# Altium schematic sheet BACKPMAN21_Charger.SchDoc
size A3
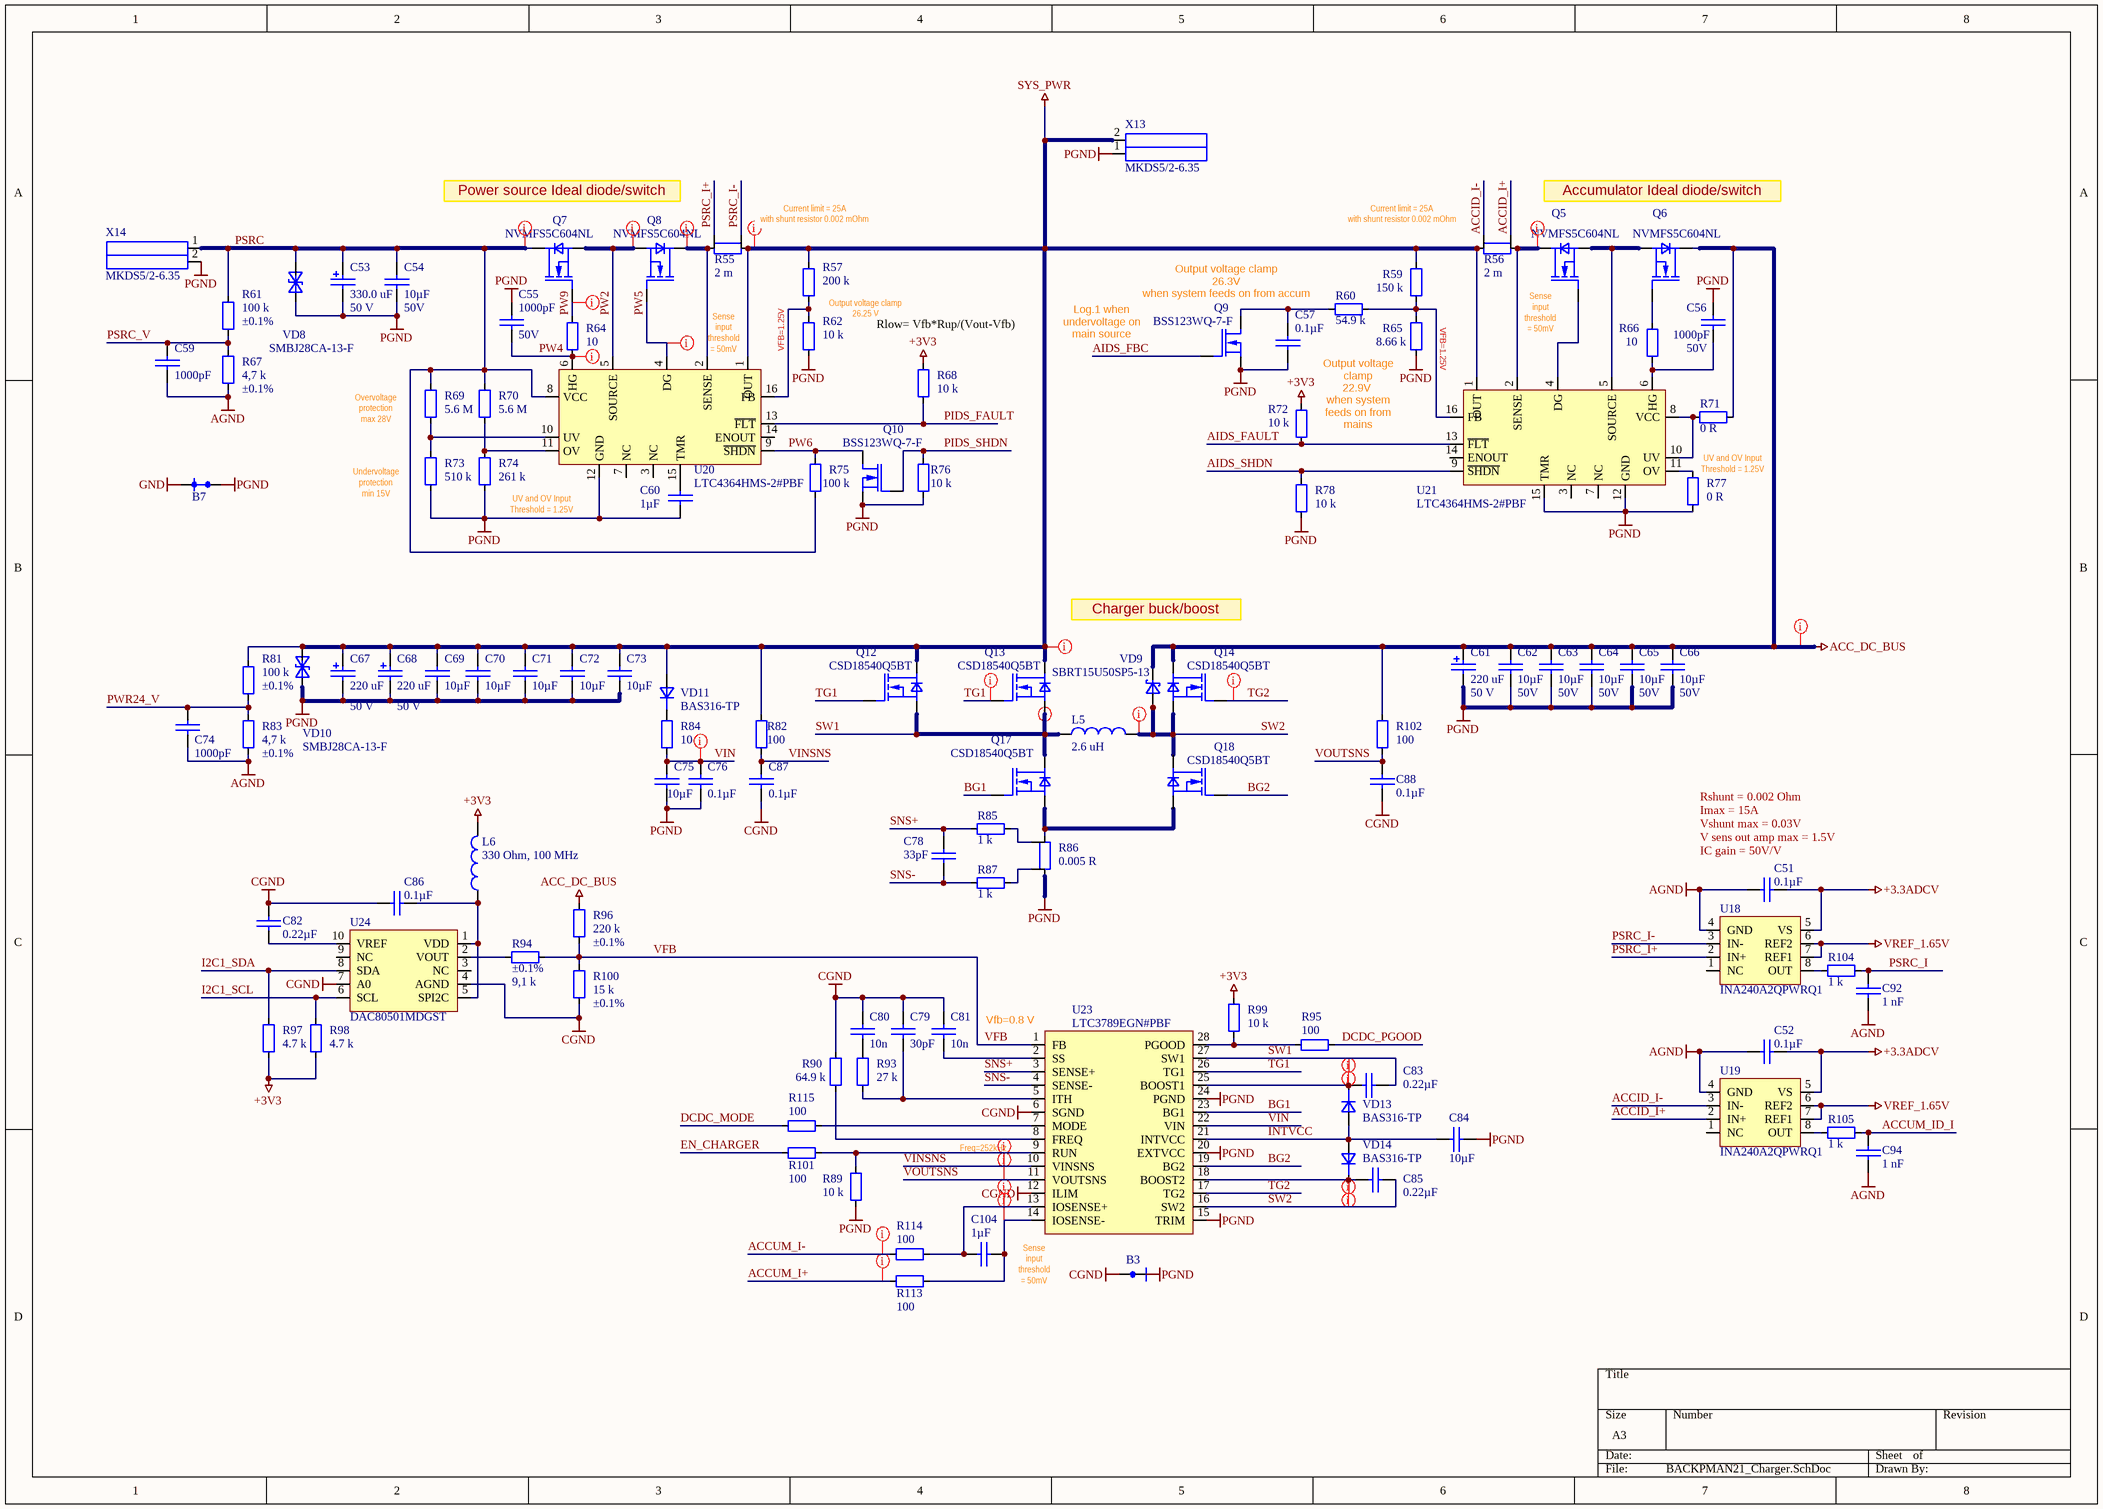
[diagram p0: BACKPMAN21_Charger.SchDoc]

## Parts
B3  Net tie 0.3mm  [Net tee 0.3 mm]  (value not drawn)  (net tie, no BOM)
B7  Net tie 1206  [Net tee 1206]  (value not drawn)  (net tie, no BOM)
C51  value 0.1µF  [0603 CAP]  (hidden comment: Capacitor)
C52  value 0.1µF  [0603 CAP]  (hidden comment: Capacitor)
C53  value 330.0 uF  Voltage: 50 V  [UUD1V331MNL1GS]  (hidden comment: EEE-FT1H331GP)
C54  value 10µF  Voltage - Rated: 50V  [1210 CAP]  (hidden comment: Capacitor)
C55  value 1000pF  Voltage - Rated: 50V  [0603 CAP]  (hidden comment: Capacitor)
C56  value 1000pF  Voltage - Rated: 50V  [0603 CAP]  (hidden comment: Capacitor)
C57  value 0.1µF  [0603 CAP]  (hidden comment: Capacitor)
C59  value 1000pF  [0603 CAP]  (hidden comment: Capacitor)
C60  value 1µF  [0603 CAP]  (hidden comment: Capacitor)
C61  value 220 uF  Voltage: 50 V  [Panasonic G]  (hidden comment: EEH-ZS1H221P)
C62  value 10µF  Voltage - Rated: 50V  [1210 CAP]  (hidden comment: Capacitor)
C63  value 10µF  Voltage - Rated: 50V  [1210 CAP]  (hidden comment: Capacitor)
C64  value 10µF  Voltage - Rated: 50V  [1210 CAP]  (hidden comment: Capacitor)
C65  value 10µF  Voltage - Rated: 50V  [1210 CAP]  (hidden comment: Capacitor)
C66  value 10µF  Voltage - Rated: 50V  [1210 CAP]  (hidden comment: Capacitor)
C67  value 220 uF  Voltage: 50 V  [Panasonic G]  (hidden comment: EEH-ZS1H221P)
C68  value 220 uF  Voltage: 50 V  [Panasonic G]  (hidden comment: EEH-ZS1H221P)
C69  value 10µF  [1210 CAP]  (hidden comment: Capacitor)
C70  value 10µF  [1210 CAP]  (hidden comment: Capacitor)
C71  value 10µF  [1210 CAP]  (hidden comment: Capacitor)
C72  value 10µF  [1210 CAP]  (hidden comment: Capacitor)
C73  value 10µF  [1210 CAP]  (hidden comment: Capacitor)
C74  value 1000pF  [0603 CAP]  (hidden comment: Capacitor)
C75  value 10µF  [1210 CAP]  (hidden comment: Capacitor)
C76  value 0.1µF  [0603 CAP]  (hidden comment: Capacitor)
C78  value 33pF  [0603 CAP]  (hidden comment: Capacitor)
C79  value 30pF  [0603 CAP]  (hidden comment: Capacitor)
C80  value 10n  [0603 CAP]  (hidden comment: Capacitor)
C81  value 10n  [0603 CAP]  (hidden comment: Capacitor)
C82  value 0.22µF  [0603 CAP]  (hidden comment: Capacitor)
C83  value 0.22µF  [0603 CAP]  (hidden comment: Capacitor)
C84  value 10µF  [0603 CAP]  (hidden comment: Capacitor)
C85  value 0.22µF  [0603 CAP]  (hidden comment: Capacitor)
C86  value 0.1µF  [0603 CAP]  (hidden comment: Capacitor)
C87  value 0.1µF  [0603 CAP]  (hidden comment: Capacitor)
C88  value 0.1µF  [0603 CAP]  (hidden comment: Capacitor)
C92  value 1 nF  [0603 CAP]  (hidden comment: Capacitor)
C94  value 1 nF  [0603 CAP]  (hidden comment: Capacitor)
C104  value 1µF  [0603 CAP]  (hidden comment: Capacitor)
L5  value 2.6 uH  [7443556260   Wurth Elektronik]  (hidden comment: 7443556260)
L6  value 330 Ohm, 100 MHz  [0603]  (hidden comment: BLM18SG331TN1D)
Q5  NVMFS5C604NL  [SO8FL Universal Footprint]
Q6  NVMFS5C604NL  [SO8FL Universal Footprint]
Q7  NVMFS5C604NL  [SO8FL Universal Footprint]
Q8  NVMFS5C604NL  [SO8FL Universal Footprint]
Q9  BSS123WQ-7-F  [SOT323-3]
Q10  BSS123WQ-7-F  [SOT323-3]
Q12  CSD18540Q5BT  [SO8FL Universal Footprint]
Q13  CSD18540Q5BT  [SO8FL Universal Footprint]
Q14  CSD18540Q5BT  [SO8FL Universal Footprint]
Q17  CSD18540Q5BT  [SO8FL Universal Footprint]
Q18  CSD18540Q5BT  [SO8FL Universal Footprint]
R55  value 2 m  [2512 shunt]  (hidden comment: Resistor_shunt)  (net tie)
R56  value 2 m  [2512 shunt]  (hidden comment: Resistor_shunt)  (net tie)
R57  value 200 k  [1206]  (hidden comment: Resistor)
R59  value 150 k  [1206]  (hidden comment: Resistor)
R60  value 54.9 k  [0603]  (hidden comment: Resistor)
R61  value 100 k  Tolerance: ±0.1%  [1206]  (hidden comment: Resistor)
R62  value 10 k  [0603]  (hidden comment: Resistor)
R64  value 10  [0805]  (hidden comment: Resistor)
R65  value 8.66 k  [0603]  (hidden comment: Resistor)
R66  value 10  [0805]  (hidden comment: Resistor)
R67  value 4,7 k  Tolerance: ±0.1%  [0603]  (hidden comment: Resistor)
R68  value 10 k  [0603]  (hidden comment: Resistor)
R69  value 5.6 M  [1206]  (hidden comment: Resistor)
R70  value 5.6 M  [1206]  (hidden comment: Resistor)
R71  value 0 R  [0603]  (hidden comment: RC0603FR-070RL)
R72  value 10 k  [0603]  (hidden comment: Resistor)
R73  value 510 k  [0603]  (hidden comment: Resistor)
R74  value 261 k  [0603]  (hidden comment: Resistor)
R75  value 100 k  [1206]  (hidden comment: Resistor)
R76  value 10 k  [0603]  (hidden comment: Resistor)
R77  value 0 R  [0603]  (hidden comment: RC0603FR-070RL)
R78  value 10 k  [0603]  (hidden comment: Resistor)
R81  value 100 k  Tolerance: ±0.1%  [1206]  (hidden comment: Resistor)
R82  value 100  [0603]  (hidden comment: Resistor)
R83  value 4,7 k  Tolerance: ±0.1%  [0603]  (hidden comment: Resistor)
R84  value 10  [0805]  (hidden comment: Resistor)
R85  value 1 k  [0603]  (hidden comment: Resistor)
R86  value 0.005 R  [FC4L110]  (hidden comment: FC4L110R005FER)
R87  value 1 k  [0603]  (hidden comment: Resistor)
R89  value 10 k  [0603]  (hidden comment: Resistor)
R90  value 64.9 k  [0603]  (hidden comment: Resistor)
R93  value 27 k  [0603]  (hidden comment: Resistor)
R94  value 9,1 k  Tolerance: ±0.1%  [0603]  (hidden comment: Resistor)
R95  value 100  [0603]  (hidden comment: Resistor)
R96  value 220 k  Tolerance: ±0.1%  [0603]  (hidden comment: Resistor)
R97  value 4.7 k  [0603]  (hidden comment: Resistor)
R98  value 4.7 k  [0603]  (hidden comment: Resistor)
R99  value 10 k  [0603]  (hidden comment: Resistor)
R100  value 15 k  Tolerance: ±0.1%  [0603]  (hidden comment: Resistor)
R101  value 100  [0603]  (hidden comment: Resistor)
R102  value 100  [0603]  (hidden comment: Resistor)
R104  value 1 k  [0603]  (hidden comment: Resistor)
R105  value 1 k  [0603]  (hidden comment: Resistor)
R113  value 100  [0603]  (hidden comment: Resistor)
R114  value 100  [0603]  (hidden comment: Resistor)
R115  value 100  [0603]  (hidden comment: Resistor)
U18  INA240A2QPWRQ1  [TI TSSOP-8]
U19  INA240A2QPWRQ1  [TI TSSOP-8]
U20  LTC4364HMS-2#PBF  [16-Lead Plastic MSOP LINEAR]
U21  LTC4364HMS-2#PBF  [16-Lead Plastic MSOP LINEAR]
U23  LTC3789EGN#PBF  [28-Lead Plastic SSOP Linear]
U24  DAC80501MDGST  [10-Lead Plastic MSOP Linear]
VD8  SMBJ28CA-13-F  [DO-214AA_SMBJ BI]
VD9  SBRT15U50SP5-13  [PowerDI 5]
VD10  SMBJ28CA-13-F  [DO-214AA_SMBJ BI]
VD11  PartName: BAS316-TP  [SOD-323]  (hidden comment: Diode)
VD13  PartName: BAS316-TP  [SOD-323]  (hidden comment: Diode)
VD14  PartName: BAS316-TP  [SOD-323]  (hidden comment: Diode)
X13  MKDS5/2-6.35  [MKDS5/2-6.35]
X14  MKDS5/2-6.35  [MKDS5/2-6.35]

## Nets
+3.3ADCV: C51.1 C52.1 U18.5(VS) U19.5(VS)
+3V3: L6.2 R68.2 R72.2 R97.1 R98.1 R99.1
ACC_DC_BUS: C61.1 C62.1 C63.1 C64.1 C65.1 C66.1 Q6.3(D) Q14.3(D) R71.2 R96.2 R102.2 VD9.3
AGND: C51.2 C52.2 C59.1 C74.1 C92.1 C94.1 R67.1 R83.1 U18.4(GND) U19.4(GND)
CGND: B3.2 C79.1 C80.1 C81.1 C82.1 C86.2 C87.2 C88.2 R90.1 R100.1 U23.6(SGND) U23.12(ILIM) U24.4(AGND) U24.7(A0)
GND: B7.1
PGND: B3.1 B7.2 C53.2 C54.2 C55.1 C56.1 C57.1 C60.1 C61.2 C62.2 C63.2 C64.2 C65.2 C66.2 C67.2 C68.2 C69.2 C70.2 C71.2 C72.2 C73.2 C75.2 C76.2 C84.2 Q9.2(S) Q10.2(S) R62.2 R65.1 R73.1 R74.1 R76.1 R77.2 R78.1 R86.1 R89.1 U20.12(GND) U21.12(GND) U21.15(TMR) U23.15(TRIM) U23.20(EXTVCC) U23.24(PGND) VD8.1(C) VD10.1(C) X13.1 X14.2
SYS_PWR: C67.1 C68.1 C69.1 C70.1 C71.1 C72.1 C73.1 Q12.3(D) Q13.3(D) R55.1 R56.2 R57.2 R59.2 R81.2 R82.2 U20.1(OUT) U21.1(OUT) VD10.2(A) VD11.2(A) X13.2
VREF_1.65V: U18.6(REF2) U18.7(REF1) U19.6(REF2) U19.7(REF1)
ACCID_I+: R56.3 U19.2(IN+)
ACCID_I-: R56.4 U19.3(IN-)
ACCUM_I+: R113.2
ACCUM_I-: R114.2
ACCUM_ID_I: C94.2 R105.2
AIDS_FAULT: R72.1 U21.13(~{FLT})
AIDS_FBC: Q9.1(G)
AIDS_SHDN: R78.2 U21.9(~{SHDN})
BG1: Q17.1(G) U23.23(BG1)
BG2: Q18.1(G) U23.19(BG2)
DCDC_MODE: R115.2
DCDC_PGOOD: R95.1
EN_CHARGER: R101.2
I2C1_SCL: R98.2 U24.6(SCL)
I2C1_SDA: R97.2 U24.8(SDA)
INTVCC: C84.1 U23.21(INTVCC) VD13.2(A) VD14.2(A)
PIDS_FAULT: R68.1 U20.13(~{FLT})
PIDS_SHDN: Q10.1(G) R76.2
PSRC: C53.1 C54.1 Q7.3(D) R61.2 R69.2 R70.2 R75.1 U20.8(VCC) VD8.2(A) X14.1
PSRC_I: C92.2 R104.2
PSRC_I+: R55.4 U18.2(IN+)
PSRC_I-: R55.3 U18.3(IN-)
PSRC_V: C59.2 R61.1 R67.2
PW2: Q7.2(S) Q8.2(S) U20.5(SOURCE)
PW4: C55.2 R64.1 U20.6(HG)
PW5: Q8.1(G) U20.4(DG)
PW6: Q10.3(D) R75.2 U20.9(~{SHDN})
PW9: Q7.1(G) R64.2
PWR24_V: C74.2 R81.1 R83.2
SNS+: C78.1 R85.2 U23.3(SENSE+)
SNS-: C78.2 R87.2 U23.4(SENSE-)
SW1: C83.2 L5.1 Q12.2(S) Q13.2(S) Q17.3(D) U23.27(SW1)
SW2: C85.2 L5.2 Q14.2(S) Q18.3(D) U23.16(SW2) VD9.1 VD9.2
TG1: Q12.1(G) Q13.1(G) U23.26(TG1)
TG2: Q14.1(G) U23.17(TG2)
VFB: R94.1 R96.1 R100.2 U23.1(FB)
VIN: C75.1 C76.1 R84.1 U23.22(VIN)
VINSNS: C87.1 R82.1 U23.10(VINSNS)
VOUTSNS: C88.1 R102.1 U23.11(VOUTSNS)
NetC56_2: C56.2 R66.1 U21.6(HG)
NetC57_2: C57.2 Q9.3(D) R60.2
NetC60_2: C60.2 U20.15(TMR)
NetC79_2: C79.2 R93.1 U23.5(ITH)
NetC80_2: C80.2 R93.2
NetC81_2: C81.2 U23.2(SS)
NetC82_2: C82.2 U24.10(VREF)
NetC83_1: C83.1 U23.25(BOOST1) VD13.1(C)
NetC85_1: C85.1 U23.18(BOOST2) VD14.1(C)
NetC86_1: C86.1 L6.1 U24.1(VDD) U24.5(SPI2C)
NetC104_1: C104.1 R113.1 U23.14(IOSENSE-)
NetC104_2: C104.2 R114.1 U23.13(IOSENSE+)
NetQ5_1: Q5.1(G) U21.4(DG)
NetQ5_2: Q5.2(S) Q6.2(S) U21.5(SOURCE)
NetQ5_3: Q5.3(D) R56.1 U21.2(SENSE)
NetQ6_1: Q6.1(G) R66.2
NetQ8_3: Q8.3(D) R55.2 U20.2(SENSE)
NetQ17_2: Q17.2(S) Q18.2(S) R86.2
NetR57_1: R57.1 R62.1 U20.16(FB)
NetR59_1: R59.1 R60.1 R65.2 U21.16(FB)
NetR69_1: R69.1 R73.2 U20.10(UV)
NetR70_1: R70.1 R74.2 U20.11(OV)
NetR71_1: R71.1 U21.8(VCC) U21.10(UV)
NetR77_1: R77.1 U21.11(OV)
NetR84_2: R84.2 VD11.1(C)
NetR85_1: R85.1 R86.4
NetR86_3: R86.3 R87.1
NetR89_2: R89.2 R101.1 U23.9(RUN)
NetR90_2: R90.2 U23.8(FREQ)
NetR94_2: R94.2 U24.2(VOUT)
NetR95_2: R95.2 R99.2 U23.28(PGOOD)
NetR104_1: R104.1 U18.8(OUT)
NetR105_1: R105.1 U19.8(OUT)
NetR115_1: R115.1 U23.7(MODE)

Not connected (* = marked no-connect by the designer): U18 1(NC); U19 1(NC); U20 3(NC) 7(NC) 14(ENOUT); U21 3(NC) 7(NC) 14(ENOUT); U24 3(NC) 9(NC)

## Layout directives
net class 24V: ACC_DC_BUS, ACCUM_I+, ACCUM_I-, NetC83_1, NetC85_1, NetC104_1, NetC104_2, NetQ5_3, NetQ8_3, PSRC, PW2, PW4, PW5, PW9, SW1, SW2, SYS_PWR, TG1, TG2, VIN, VINSNS, VOUTSNS

## Notes on the sheet
- Power source Ideal diode/switch
- Current limit = 25A
  with shunt resistor 0.002 mOhm
- Accumulator Ideal diode/switch
- Output voltage clamp
  26.25 V
- (near R60) Output voltage clamp
  26.3V
  when system feeds on from accum
- (near U20) Sense input threshold = 50mV
- VFB=1.25V
- (near R68) Rlow= Vfb*Rup/(Vout-Vfb)
- Log.1 when undervoltage on main source
- (near Q5) Sense input threshold = 50mV
- Overvoltage protection
  max 28V
- Output voltage clamp
  22.9V
  when system feeds on from mains
- (near R73) Undervoltage protection
  min 15V
- (near R74) UV and OV Input Threshold = 1.25V
- (near R77) UV and OV Input Threshold = 1.25V
- Charger buck/boost
- (near C51) Rshunt = 0.002 Ohm
  Imax = 15A
  Vshunt max = 0.03V
  V sens out amp max = 1.5V
  IC gain = 50V/V
- (near U23) Vfb=0.8 V
- (near U23) Freq=252kHz
- Sense input threshold = 50mV

## Library data of the parts
C51 C52 C76 C87 C88 = GCM188L81H104KA57D: 0.1µF, ±10%, 50V, X8L, 0603 (1608 Metric), -55°C ~ 150°C, -, Automotive; Manufacturer: Murata Electronics North America; PartNum: 490-6049-1-ND; Voltage - Rated: 50V; Part Number: GCM188L81H104KA57D; Distributor: Digi-Key; PartName: GCM188L81H104KA57D; Price: 0.06240; Tolerance: ±10%; Temperature Coefficient: X8L; Operating Temperature: -55°C ~ 150°C; Features: -; Package / Case: 0603 (1608 Metric)
C53 = EEE-FT1H331GP: 330 uF, 50V, 120 mOhm @ 100kHz, 585 mA, 10x10, -50...+105 C; Manufacturer: Panasonic Electronic Components; Tolerance: ±20%; Distributor: Digi-Key; Price: 1.22$; PartNum: EEE-FT1H331GP; PartName: EEE-FT1H331GP
C54 C62-C66 C69-C73 C75 = C3225X7S1H106K250AB: 10µF, ±10%, 50V, X7S, 1210 (3225 Metric), -55°C ~ 125°C, Low ESL, General Purpose; Manufacturer: TDK Corporation; PartNum: 445-4536-1-ND; Part Number: C3225X7S1H106K250AB; Distributor: Digi-Key; PartName: C3225X7S1H106K250AB; Price: 0.71160; Tolerance: ±10%; Temperature Coefficient: X7S; Operating Temperature: -55°C ~ 125°C; Features: Low ESL; Package / Case: 1210 (3225 Metric)
  C69-C73 C75: Voltage - Rated: 50V
C55 C56 = CL10B102KB8NNWC: 1000pF, ±10%, 50V, X7R, 0603 (1608 Metric), -55°C ~ 125°C, -, General Purpose; Manufacturer: Samsung Electro-Mechanics; PartNum: 1276-1915-1-ND; Part Number: CL10B102KB8NNWC; Distributor: Digi-Key; PartName: CL10B102KB8NNWC; Price: 0.01410; Tolerance: ±10%; Temperature Coefficient: X7R; Operating Temperature: -55°C ~ 125°C; Features: -; Package / Case: 0603 (1608 Metric)
C57 C86 = CL10B104KO8NNNC: 0.1µF, ±10%, 16V, X7R, 0603 (1608 Metric), -55°C ~ 125°C, -, General Purpose; Manufacturer: Samsung Electro-Mechanics; PartNum: 1276-1005-1-ND; Voltage - Rated: 16V; Part Number: CL10B104KO8NNNC; Distributor: Digi-Key; PartName: CL10B104KO8NNNC; Price: 0.01480; Tolerance: ±10%; Temperature Coefficient: X7R; Operating Temperature: -55°C ~ 125°C; Features: -; Package / Case: 0603 (1608 Metric)
C59 C74 = 885012206034: 1000pF, ±10%, 16V, X7R, 0603 (1608 Metric), -55°C ~ 125°C, -, General Purpose; Manufacturer: Wurth Electronics Inc.; PartNum: 732-7953-1-ND; Voltage - Rated: 16V; Part Number: 885012206034; Distributor: Digi-Key; PartName: 885012206034; Price: 0.01920; Tolerance: ±10%; Temperature Coefficient: X7R; Operating Temperature: -55°C ~ 125°C; Features: -; Package / Case: 0603 (1608 Metric)
C60 C104 = CL10B105KO8NNNC: 1µF, ±10%, 16V, X7R, 0603 (1608 Metric), -55°C ~ 125°C, -, General Purpose; Manufacturer: Samsung Electro-Mechanics; PartNum: 1276-1019-1-ND; Voltage - Rated: 16V; Part Number: CL10B105KO8NNNC; Distributor: Digi-Key; PartName: CL10B105KO8NNNC; Price: 0.02250; Tolerance: ±10%; Temperature Coefficient: X7R; Operating Temperature: -55°C ~ 125°C; Features: -; Package / Case: 0603 (1608 Metric)
C61 C67 C68 = EEH-ZS1H221P: 220 uF, 50V, 13 mOhm, 3.7 A 100kHz, 16.8 mm height, 10.3x10.3 mm, -55...+105 C; Manufacturer: Panasonic Electronic Components; PartNum: P124104CT-ND; Tolerance: ±20%; Distributor: Digi-Key; Price: 2.54$; PartName: EEH-ZS1H221P
C78 = 885012006054: 33pF, ±5%, 50V, C0G, NP0, 0603 (1608 Metric), -55°C ~ 125°C, -, General Purpose; Manufacturer: Wurth Electronics Inc.; PartNum: 732-7796-1-ND; Voltage - Rated: 50V; Part Number: 885012006054; Distributor: Digi-Key; PartName: 885012006054; Price: 0.02150; Tolerance: ±5%; Temperature Coefficient: C0G, NP0; Operating Temperature: -55°C ~ 125°C; Features: -; Package / Case: 0603 (1608 Metric)
C79 = CL10C300JB8NCNC: 30pF, ±5%, 50V, C0G, NP0, 0603 (1608 Metric), -55°C ~ 125°C, -, General Purpose; Manufacturer: Samsung Electro-Mechanics; PartNum: 1276-2260-1-ND; Part Number: CL10C300JB8NCNC; Distributor: Digi-Key; PartName: CL10C300JB8NCNC; Price: 0.01670; Tolerance: ±5%; Voltage - Rated: 50V; Temperature Coefficient: C0G, NP0; Operating Temperature: -55°C ~ 125°C; Features: -; Package / Case: 0603 (1608 Metric)
C80 C81 = C0603C103K3RACTU: 10000pF, ±10%, 25V, X7R, 0603 (1608 Metric), -55°C ~ 125°C, -, General Purpose; Manufacturer: KEMET; PartNum: 399-7840-1-ND; Voltage - Rated: 25V; Part Number: C0603C103K3RACTU; Distributor: Digi-Key; PartName: C0603C103K3RACTU; Price: 0.01690; Tolerance: ±10%; Temperature Coefficient: X7R; Operating Temperature: -55°C ~ 125°C; Features: -; Package / Case: 0603 (1608 Metric)
C82 C83 C85 = GRM188R71C224KA01J: 0.22µF, ±10%, 16V, X7R, 0603 (1608 Metric), -55°C ~ 125°C, -, General Purpose; Manufacturer: Murata Electronics North America; PartNum: 490-11513-1-ND; Voltage - Rated: 16V; Part Number: GRM188R71C224KA01J; Distributor: Digi-Key; PartName: GRM188R71C224KA01J; Price: 0.06940; Tolerance: ±10%; Temperature Coefficient: X7R; Operating Temperature: -55°C ~ 125°C; Features: -; Package / Case: 0603 (1608 Metric)
C84 = C1608X5R1E106M080AC: 10µF, ±20%, 25V, X5R, 0603 (1608 Metric), -55°C ~ 85°C, Low ESL, General Purpose; Manufacturer: TDK Corporation; PartNum: 445-9015-1-ND; Part Number: C1608X5R1E106M080AC; Distributor: Digi-Key; PartName: C1608X5R1E106M080AC; Price: 0.48300; Tolerance: ±20%; Voltage - Rated: 25V; Temperature Coefficient: X5R; Operating Temperature: -55°C ~ 85°C; Features: Low ESL; Package / Case: 0603 (1608 Metric)
C92 C94 = CC0603JRX7R9BB102: 1000pF, ±5%, 50V, X7R, 0603 (1608 Metric), -55°C ~ 125°C, -, General Purpose; Manufacturer: Yageo; PartNum: 311-3361-1-ND; Voltage - Rated: 50V; Part Number: CC0603JRX7R9BB102; Distributor: Digi-Key; PartName: CC0603JRX7R9BB102; Price: 0.01920; Tolerance: ±5%; Temperature Coefficient: X7R; Operating Temperature: -55°C ~ 125°C; Features: -; Package / Case: 0603 (1608 Metric)
L5 = 7443556260: 2.6 uH, 31.5 A, ±20%, 1.58 mOhm, -40°C ~ 125°C; Manufacturer: Würth Elektronik; PartNum: 732-2170-1-ND; Distributor: Digi-Key; Price: 5.35$; Tolerance: ±20%; PartName: 7443556260
L6 = BLM18SG331TN1D: Ferrite bead, 330 Ohm, 100 MHz,  1.5 A, 0.07 Ohm; Manufacturer: Murata Electronics North America; Tolerance: 25%; Distributor: Future; Price: 0.03 Euro; PartNum: BLM18SG331TN1D; PartName: BLM18SG331TN1D
Q5-Q8 = NVMFS5C604NLAFT1G: MOSFET N-CH, 287 A, 60V, Vgs=±20V, 1.2 mOhm, 52nC @ 4.5V, 5-DFN (5x6), -55°C ~ 175°C; Manufacturer: Texas Instruments; PartNum: NVMFS5C604NLAFT1GOSCT-ND; Price: 2.68$; Distributor: Digi-Key; PartName: NVMFS5C604NLAFT1G
Q9 Q10 = BSS123WQ-7-F: MOSFETs N-CH, 2V @ 1mA, 6 Ohm @ 170mA, 10V, 170mA, 100V, SOT-323,  -55°C ~ 150°C; Manufacturer: Diodes Incorporated; PartNum: BSS123WQ-7-FDICT-ND; Distributor: Digi-Key; Price: 0.2$; PartName: BSS123WQ-7-F
Q12-Q14 Q17 Q18 = CSD18540Q5BT: MOSFET N-CH, 100 A, 60V, Vgs=±20V, 1.8 mOhm, 41nC @ 10V, 5-DFN (5x6), -55°C ~ 150°C; Manufacturer: Texas Instruments; PartNum: 296-37963-1-ND; Price: 2.32 Euro; Distributor: Digi-Key; PartName: CSD18540Q5BT; Supplier 1: Digi-Key; Supplier Part Number 1: 296-37963-1-ND
R55 R56 = WSLF25122L000FEA: 2 mOhms, ±1%, 5W, Metal Element, ±70ppm/°C, 2512 (6432 Metric), -65°C ~ 170°C, Current Sense, Moisture Resistant, Pulse Withstanding; Manufacturer: Vishay Dale; PartNum: 541-3126-1-ND; Distributor: Digi-Key; Price: 0.43430; Tolerance: ±1%; PartName: WSLF25122L000FEA; Part Number: WSLF25122L000FEA; Temperature Coefficient: ±70ppm/°C; Operating Temperature: -65°C ~ 170°C; Power (Watts): 5W; Features: Current Sense, Moisture Resistant, Pulse Withstanding; Package / Case: 2512 (6432 Metric)
R57 = RMCF1206FT200K: 200 kOhms, ±1%, 0.25W, 1/4W, Thick Film, ±100ppm/°C, 1206 (3216 Metric), -55°C ~ 155°C, Automotive AEC-Q200; Manufacturer: Stackpole Electronics Inc.; PartNum: RMCF1206FT200KCT-ND; Voltage: 200V; Distributor: Digi-Key; Price: 0.01410; Tolerance: ±1%; PartName: RMCF1206FT200K; Part Number: RMCF1206FT200K; Temperature Coefficient: ±100ppm/°C; Operating Temperature: -55°C ~ 155°C; Power (Watts): 0.25W, 1/4W; Features: Automotive AEC-Q200; Package / Case: 1206 (3216 Metric)
R59 = RMCF1206FG150K: 150 kOhms, ±1%, 0.25W, 1/4W, Thick Film, ±100ppm/°C, 1206 (3216 Metric), -55°C ~ 155°C, Automotive AEC-Q200; Manufacturer: Stackpole Electronics Inc.; PartNum: RMCF1206FG150KCT-ND; Voltage: 200V; Distributor: Digi-Key; Price: 0.01500; Tolerance: ±1%; PartName: RMCF1206FG150K; Part Number: RMCF1206FG150K; Temperature Coefficient: ±100ppm/°C; Operating Temperature: -55°C ~ 155°C; Power (Watts): 0.25W, 1/4W; Features: Automotive AEC-Q200; Package / Case: 1206 (3216 Metric)
R60 = RMCF0603FT54K9: 54.9 kOhms, ±1%, 0.1W, 1/10W, Thick Film, ±100ppm/°C, 0603 (1608 Metric), -55°C ~ 155°C, Automotive AEC-Q200; Manufacturer: Stackpole Electronics Inc.; PartNum: RMCF0603FT54K9CT-ND; Voltage: 75V; Distributor: Digi-Key; Price: 0.00690; Tolerance: ±1%; PartName: RMCF0603FT54K9; Part Number: RMCF0603FT54K9; Temperature Coefficient: ±100ppm/°C; Operating Temperature: -55°C ~ 155°C; Power (Watts): 0.1W, 1/10W; Features: Automotive AEC-Q200; Package / Case: 0603 (1608 Metric)
R61 R81 = RMCF1206FT100K: 100 kOhms, ±0.1%, 0.25W, 1/4W, Thick Film, ±15ppm/°C, 1206 (3216 Metric), -55°C ~ 155°C, Automotive AEC-Q200; Manufacturer: Panasonic Electronic Components; PartNum: ERA-8APB104V; Voltage: 200V; Distributor: Digi-Key; Price: 0.88$; PartName: ERA-8APB104V; Part Number: ERA-8APB104V; Temperature Coefficient: ±15ppm/°C; Operating Temperature: -55°C ~ 155°C; Power (Watts): 0.25W, 1/4W; Features: Automotive AEC-Q200; Package / Case: 1206 (3216 Metric)
R62 R68 R72 R76 R78 R89 R99 = CR0603-FX-1002GLF: 10 kOhms, ±1%, 0.1W, 1/10W, Thick Film, ±100ppm/°C, 0603 (1608 Metric), -55°C ~ 155°C, Moisture Resistant; Manufacturer: Bourns Inc.; PartNum: CR0603-FX-1002GLFCT-ND; Voltage: 75V; Distributor: Digi-Key; Price: 0.00860; Tolerance: ±1%; PartName: CR0603-FX-1002GLF; Part Number: CR0603-FX-1002GLF; Temperature Coefficient: ±100ppm/°C; Operating Temperature: -55°C ~ 155°C; Power (Watts): 0.1W, 1/10W; Features: Moisture Resistant; Package / Case: 0603 (1608 Metric)
R64 R66 R84 = RMCF0805FT10R0: 10 Ohms, ±1%, 0.125W, 1/8W, Thick Film, ±100ppm/°C, 0805 (2012 Metric), -55°C ~ 155°C, Automotive AEC-Q200; Manufacturer: Stackpole Electronics Inc.; PartNum: RMCF0805FT10R0CT-ND; Voltage: 150V; Distributor: Digi-Key; Price: 0.00950; Tolerance: ±1%; PartName: RMCF0805FT10R0; Part Number: RMCF0805FT10R0; Temperature Coefficient: ±100ppm/°C; Operating Temperature: -55°C ~ 155°C; Power (Watts): 0.125W, 1/8W; Features: Automotive AEC-Q200; Package / Case: 0805 (2012 Metric)
R65 = RMCF0603FT8K66: 8.66 kOhms, ±1%, 0.1W, 1/10W, Thick Film, ±100ppm/°C, 0603 (1608 Metric), -55°C ~ 155°C, Automotive AEC-Q200; Manufacturer: Stackpole Electronics Inc.; PartNum: RMCF0603FT8K66CT-ND; Voltage: 75V; Distributor: Digi-Key; Price: 0.00690; Tolerance: ±1%; PartName: RMCF0603FT8K66; Part Number: RMCF0603FT8K66; Temperature Coefficient: ±100ppm/°C; Operating Temperature: -55°C ~ 155°C; Power (Watts): 0.1W, 1/10W; Features: Automotive AEC-Q200; Package / Case: 0603 (1608 Metric)
R67 R83 = ERA-3AEB472V: 4,7 kOhms, ±0.1%, 0.1W, 1/10W, Thin Film, ±25ppm/°C, 0603 (1608 Metric), -55°C ~ 155°C, Automotive AEC-Q200; Manufacturer: Panasonic Electronic Components; PartNum: P4.7KDBCT-ND; Voltage: 75V; Distributor: Digi-Key; Price: 0.26; PartName: ERA-3AEB472V; Part Number: ERA-3AEB472V; Temperature Coefficient: ±25ppm/°C; Operating Temperature: -55°C ~ 155°C; Power (Watts): 0.1W, 1/10W; Features: Automotive AEC-Q200; Package / Case: 0603 (1608 Metric)
R69 R70 = RC1206FR-075M6L: 5.6 MOhms, ±1%, 0.25W, 1/4W, Thick Film, ±100ppm/°C, 1206 (3216 Metric), -55°C ~ 155°C, Moisture Resistant; Manufacturer: Yageo; PartNum: 311-5.60MFRCT-ND; Voltage: 200V; Distributor: Digi-Key; Price: 0.03010; Tolerance: ±1%; PartName: RC1206FR-075M6L; Part Number: RC1206FR-075M6L; Temperature Coefficient: ±100ppm/°C; Operating Temperature: -55°C ~ 155°C; Power (Watts): 0.25W, 1/4W; Features: Moisture Resistant; Package / Case: 1206 (3216 Metric)
R71 R77 = RC0603FR-070RL: 0 R, Jumper, 0603, SMD Resistor, -55°C ~ 155°C; Manufacturer: Yageo; PartNum: 311-0.0HRCT-ND; Voltage: 75 V; Distributor: Digi-Key; Price: 0.005$; PartName: RC0603FR-070RL
R73 = RMCF0603FT510K: 510 kOhms, ±1%, 0.1W, 1/10W, Thick Film, ±100ppm/°C, 0603 (1608 Metric), -55°C ~ 155°C, Automotive AEC-Q200; Manufacturer: Stackpole Electronics Inc.; PartNum: RMCF0603FT510KCT-ND; Voltage: 75V; Distributor: Digi-Key; Price: 0.00690; Tolerance: ±1%; PartName: RMCF0603FT510K; Part Number: RMCF0603FT510K; Temperature Coefficient: ±100ppm/°C; Operating Temperature: -55°C ~ 155°C; Power (Watts): 0.1W, 1/10W; Features: Automotive AEC-Q200; Package / Case: 0603 (1608 Metric)
R74 = CRCW0603261KFKEA: 261 kOhms, ±1%, 0.1W, 1/10W, Thick Film, ±100ppm/°C, 0603 (1608 Metric), -55°C ~ 155°C, Automotive AEC-Q200; Manufacturer: Vishay Dale; PartNum: 541-261KHCT-ND; Voltage: 75V; Distributor: Digi-Key; Price: 0.01700; Tolerance: ±1%; PartName: CRCW0603261KFKEA; Part Number: CRCW0603261KFKEA; Temperature Coefficient: ±100ppm/°C; Operating Temperature: -55°C ~ 155°C; Power (Watts): 0.1W, 1/10W; Features: Automotive AEC-Q200; Package / Case: 0603 (1608 Metric)
R75 = RMCF1206FT100K: 100 kOhms, ±1%, 0.25W, 1/4W, Thick Film, ±100ppm/°C, 1206 (3216 Metric), -55°C ~ 155°C, Automotive AEC-Q200; Manufacturer: Stackpole Electronics Inc.; PartNum: RMCF1206FT100KCT-ND; Voltage: 200V; Distributor: Digi-Key; Price: 0.01410; Tolerance: ±1%; PartName: RMCF1206FT100K; Part Number: RMCF1206FT100K; Temperature Coefficient: ±100ppm/°C; Operating Temperature: -55°C ~ 155°C; Power (Watts): 0.25W, 1/4W; Features: Automotive AEC-Q200; Package / Case: 1206 (3216 Metric)
R82 R95 R101 R102 R113-R115 = RMCF0603FT100R: 100 Ohms, ±1%, 0.1W, 1/10W, Thick Film, ±100ppm/°C, 0603 (1608 Metric), -55°C ~ 155°C, Automotive AEC-Q200; Manufacturer: Stackpole Electronics Inc.; PartNum: RMCF0603FT100RCT-ND; Voltage: 75V; Distributor: Digi-Key; Price: 0.00690; Tolerance: ±1%; PartName: RMCF0603FT100R; Part Number: RMCF0603FT100R; Temperature Coefficient: ±100ppm/°C; Operating Temperature: -55°C ~ 155°C; Power (Watts): 0.1W, 1/10W; Features: Automotive AEC-Q200; Package / Case: 0603 (1608 Metric)
R85 R87 R104 R105 = RMCF0603FG1K00: 1 kOhms, ±1%, 0.1W, 1/10W, Thick Film, ±100ppm/°C, 0603 (1608 Metric), -55°C ~ 155°C, Automotive AEC-Q200; Manufacturer: Stackpole Electronics Inc.; PartNum: RMCF0603FG1K00CT-ND; Voltage: 75V; Distributor: Digi-Key; Price: 0.00690; Tolerance: ±1%; PartName: RMCF0603FG1K00; Part Number: RMCF0603FG1K00; Temperature Coefficient: ±100ppm/°C; Operating Temperature: -55°C ~ 155°C; Power (Watts): 0.1W, 1/10W; Features: Automotive AEC-Q200; Package / Case: 0603 (1608 Metric)
R86 = FC4L110R005FER: Curr.sens.res. 0.005 OHM 5W 1% , 4320 (50110 Metric); Manufacturer: Ohmite; PartNum: 588-FC4L110R005FER; Distributor: Digi-Key; Price: 2.42; Tolerance: 1%; PartName: FC4L110R005FER
R90 = RMCF0603FT64K9: 64.9 kOhms, ±1%, 0.1W, 1/10W, Thick Film, ±100ppm/°C, 0603 (1608 Metric), -55°C ~ 155°C, Automotive AEC-Q200; Manufacturer: Stackpole Electronics Inc.; PartNum: RMCF0603FT64K9CT-ND; Voltage: 75V; Distributor: Digi-Key; Price: 0.00690; Tolerance: ±1%; PartName: RMCF0603FT64K9; Part Number: RMCF0603FT64K9; Temperature Coefficient: ±100ppm/°C; Operating Temperature: -55°C ~ 155°C; Power (Watts): 0.1W, 1/10W; Features: Automotive AEC-Q200; Package / Case: 0603 (1608 Metric)
R93 = RMCF0603FT27K0: 27 kOhms, ±1%, 0.1W, 1/10W, Thick Film, ±100ppm/°C, 0603 (1608 Metric), -55°C ~ 155°C, Automotive AEC-Q200; Manufacturer: Stackpole Electronics Inc.; PartNum: RMCF0603FT27K0CT-ND; Voltage: 75V; Distributor: Digi-Key; Price: 0.00690; Tolerance: ±1%; PartName: RMCF0603FT27K0; Part Number: RMCF0603FT27K0; Temperature Coefficient: ±100ppm/°C; Operating Temperature: -55°C ~ 155°C; Power (Watts): 0.1W, 1/10W; Features: Automotive AEC-Q200; Package / Case: 0603 (1608 Metric)
R94 = ERA-3AEB912V: 9,1 kOhms, ±0.1%, 0.1W, 1/10W, Thin Film, ±25ppm/°C, 0603 (1608 Metric), -55°C ~ 155°C, Automotive AEC-Q200; Manufacturer: Panasonic Electronic Components; PartNum: P9.1KDBCT-ND; Voltage: 75V; Distributor: Digi-Key; Price: 0.26; PartName: ERA-3AEB912V; Part Number: ERA-3AEB912V; Temperature Coefficient: ±25ppm/°C; Operating Temperature: -55°C ~ 155°C; Power (Watts): 0.1W, 1/10W; Features: Automotive AEC-Q200; Package / Case: 0603 (1608 Metric)
R96 = ERA-3AEB224V: 220 kOhms, ±0.1%, 0.1W, 1/10W, Thin Film, ±25ppm/°C, 0603 (1608 Metric), -55°C ~ 155°C, Automotive AEC-Q200; Manufacturer: Panasonic Electronic Components; PartNum: P220KDBCT-ND; Voltage: 75V; Distributor: Digi-Key; Price: 0.26; PartName: ERA-3AEB224V; Part Number: ERA-3AEB224V; Temperature Coefficient: ±25ppm/°C; Operating Temperature: -55°C ~ 155°C; Power (Watts): 0.1W, 1/10W; Features: Automotive AEC-Q200; Package / Case: 0603 (1608 Metric)
R97 R98 = RMCF0603FT4K70: 4.7 kOhms, ±1%, 0.1W, 1/10W, Thick Film, ±100ppm/°C, 0603 (1608 Metric), -55°C ~ 155°C, Automotive AEC-Q200; Manufacturer: Stackpole Electronics Inc.; PartNum: RMCF0603FT4K70CT-ND; Voltage: 75V; Distributor: Digi-Key; Price: 0.00690; Tolerance: ±1%; PartName: RMCF0603FT4K70; Part Number: RMCF0603FT4K70; Temperature Coefficient: ±100ppm/°C; Operating Temperature: -55°C ~ 155°C; Power (Watts): 0.1W, 1/10W; Features: Automotive AEC-Q200; Package / Case: 0603 (1608 Metric)
R100 = ERA-3AEB153V: 15 kOhms, ±0.1%, 0.1W, 1/10W, Thin Film, ±25ppm/°C, 0603 (1608 Metric), -55°C ~ 155°C, Automotive AEC-Q200; Manufacturer: Panasonic Electronic Components; PartNum: P15KDBCT-ND; Voltage: 75V; Distributor: Digi-Key; Price: 0.26; PartName: ERA-3AEB153V; Part Number: ERA-3AEB153V; Temperature Coefficient: ±25ppm/°C; Operating Temperature: -55°C ~ 155°C; Power (Watts): 0.1W, 1/10W; Features: Automotive AEC-Q200; Package / Case: 0603 (1608 Metric)
U18 U19 = INA240A2QPWRQ1: Current Sense Amplifier, 50V/V, 2V/us, 400KHz, -40°C ~ 125°C, 8-TSSOP; Manufacturer: Texas Instruments; PartNum: 296-50473-1-ND; Price: 3.48$; Distributor: Digi-Key; PartName: INA240A2QPWRQ1; Supplier 1: Digi-Key; Supplier Part Number 1: 296-50473-1-ND
U20 U21 = LTC4364HMS-2#PBF: Surge Stopper  with Ideal Diode, 4-80V, 16-Lead MSOP, -40°C...125°C; Manufacturer: Analog Devices; PartNum: LTC4364HMS-2#PBF-ND; Distributor: Digi-Key; Price: 5.66$; PartName: LTC4364HMS-2#PBF; Supplier 1: Digi-Key; Supplier Part Number 1: LTC4364HMS-2#PBF-ND
U23 = LTC3789EGN#PBF: Buck-Boost Regulator Positive Output Step-Up/Step-Down DC-DC Controller IC, 28-SSOP, -40°C ~ 125°C; Manufacturer: Linear Technology/Analog Devices; PartNum: LTC3789EGN#PBF-ND; Distributor: Digi-Key; PartName: LTC3789EGN#PBF; price: 5.6$; Supplier 1: Digi-Key; Supplier Part Number 1: LTC3789EGN#PBF-ND
U24 = DAC80501MDGST: 10-Bit Digital-to-Analog Converter with Two-Wire Interface; Manufacturer: Texas Instruments; PartNum: 296-DAC80501MDGSTCT-ND; Distributor: Digi-Key; PartName: DAC80501MDGST; Price: 6$; Supplier 1: Digi-Key; Supplier Part Number 1: 296-DAC80501MDGSTCT-ND
VD8 VD10 = SMBJ28CA-13-F: TVS 600W, Vbr=31.1V, Vcl=45.4V, Ipp=13.2A,  Bidirectional, SMB, -55°C ~ 150°C; Manufacturer: Diodes Incorporated; PartNum: SMBJ28CA-FDICT-ND; Distributor: Digi-Key; Price: 0.21$; PartName: SMBJ28CA-13-F
VD9 = SBRT15U50SP5-13: Schottky Power Rectifier 15A, 50V, 470mV @ 15A, SMA, -65°C ~ 150°C; Manufacturer: Diodes Incorporated; PartNum: SBRT15U50SP5-13DICT-ND; Price: 0.83$; Distributor: Digi-Key; PartName: SBRT15U50SP5-13
VD11 VD13 VD14 = BAS316-TP: Diode 100V, 250mA (DC), 1.25V @ 150mA, 4ns, SC-76, SOD-323, -65°C ~ 150°C; Manufacturer: Micro Commercial Co; PartNum: BAS316-TPMSCT-ND; Speed: Fast Recovery =< 500ns, > 200mA (Io); Current - Reverse Leakage @ Vr: 1µA @ 75V; Part Number: BAS316-TP; Distributor: Digi-Key; Price: 0.22000; Voltage - DC Reverse (Vr) (Max): 100V; Current - Average Rectified (Io): 250mA (DC); Voltage - Forward (Vf) (Max) @ If: 1.25V @ 150mA; Reverse Recovery Time (trr): 4ns; Operating Temperature: -65°C ~ 150°C; Package / Case: SC-76, SOD-323
X13 X14 = MKDS5/2-6.35: TERMINAL BLOCK, 2WAY, 6.35 mm, 32A, 500V; Manufacturer: Phoenix Contacts; PartNum: 3704683; Distributor: Farnell; Price: 1.49 Euro